# EasyEDA Pro project ProPrj_Xen_2025-02-04.epro, schematic Schematic1

## Sheets
1 Multiplex: Board Name: XenController; Create Date: 2024-12-16; Page Name: Multiplex; Project Name: Xen; Schematic Name: Schematic1; Update Date: 2025-01-13; Company: EasyEDA.com; Drawn: EasyEDA; Page Size: A4; Part Number: JLCPCB-002; Reviewed: EasyEDA; Version: V0.1
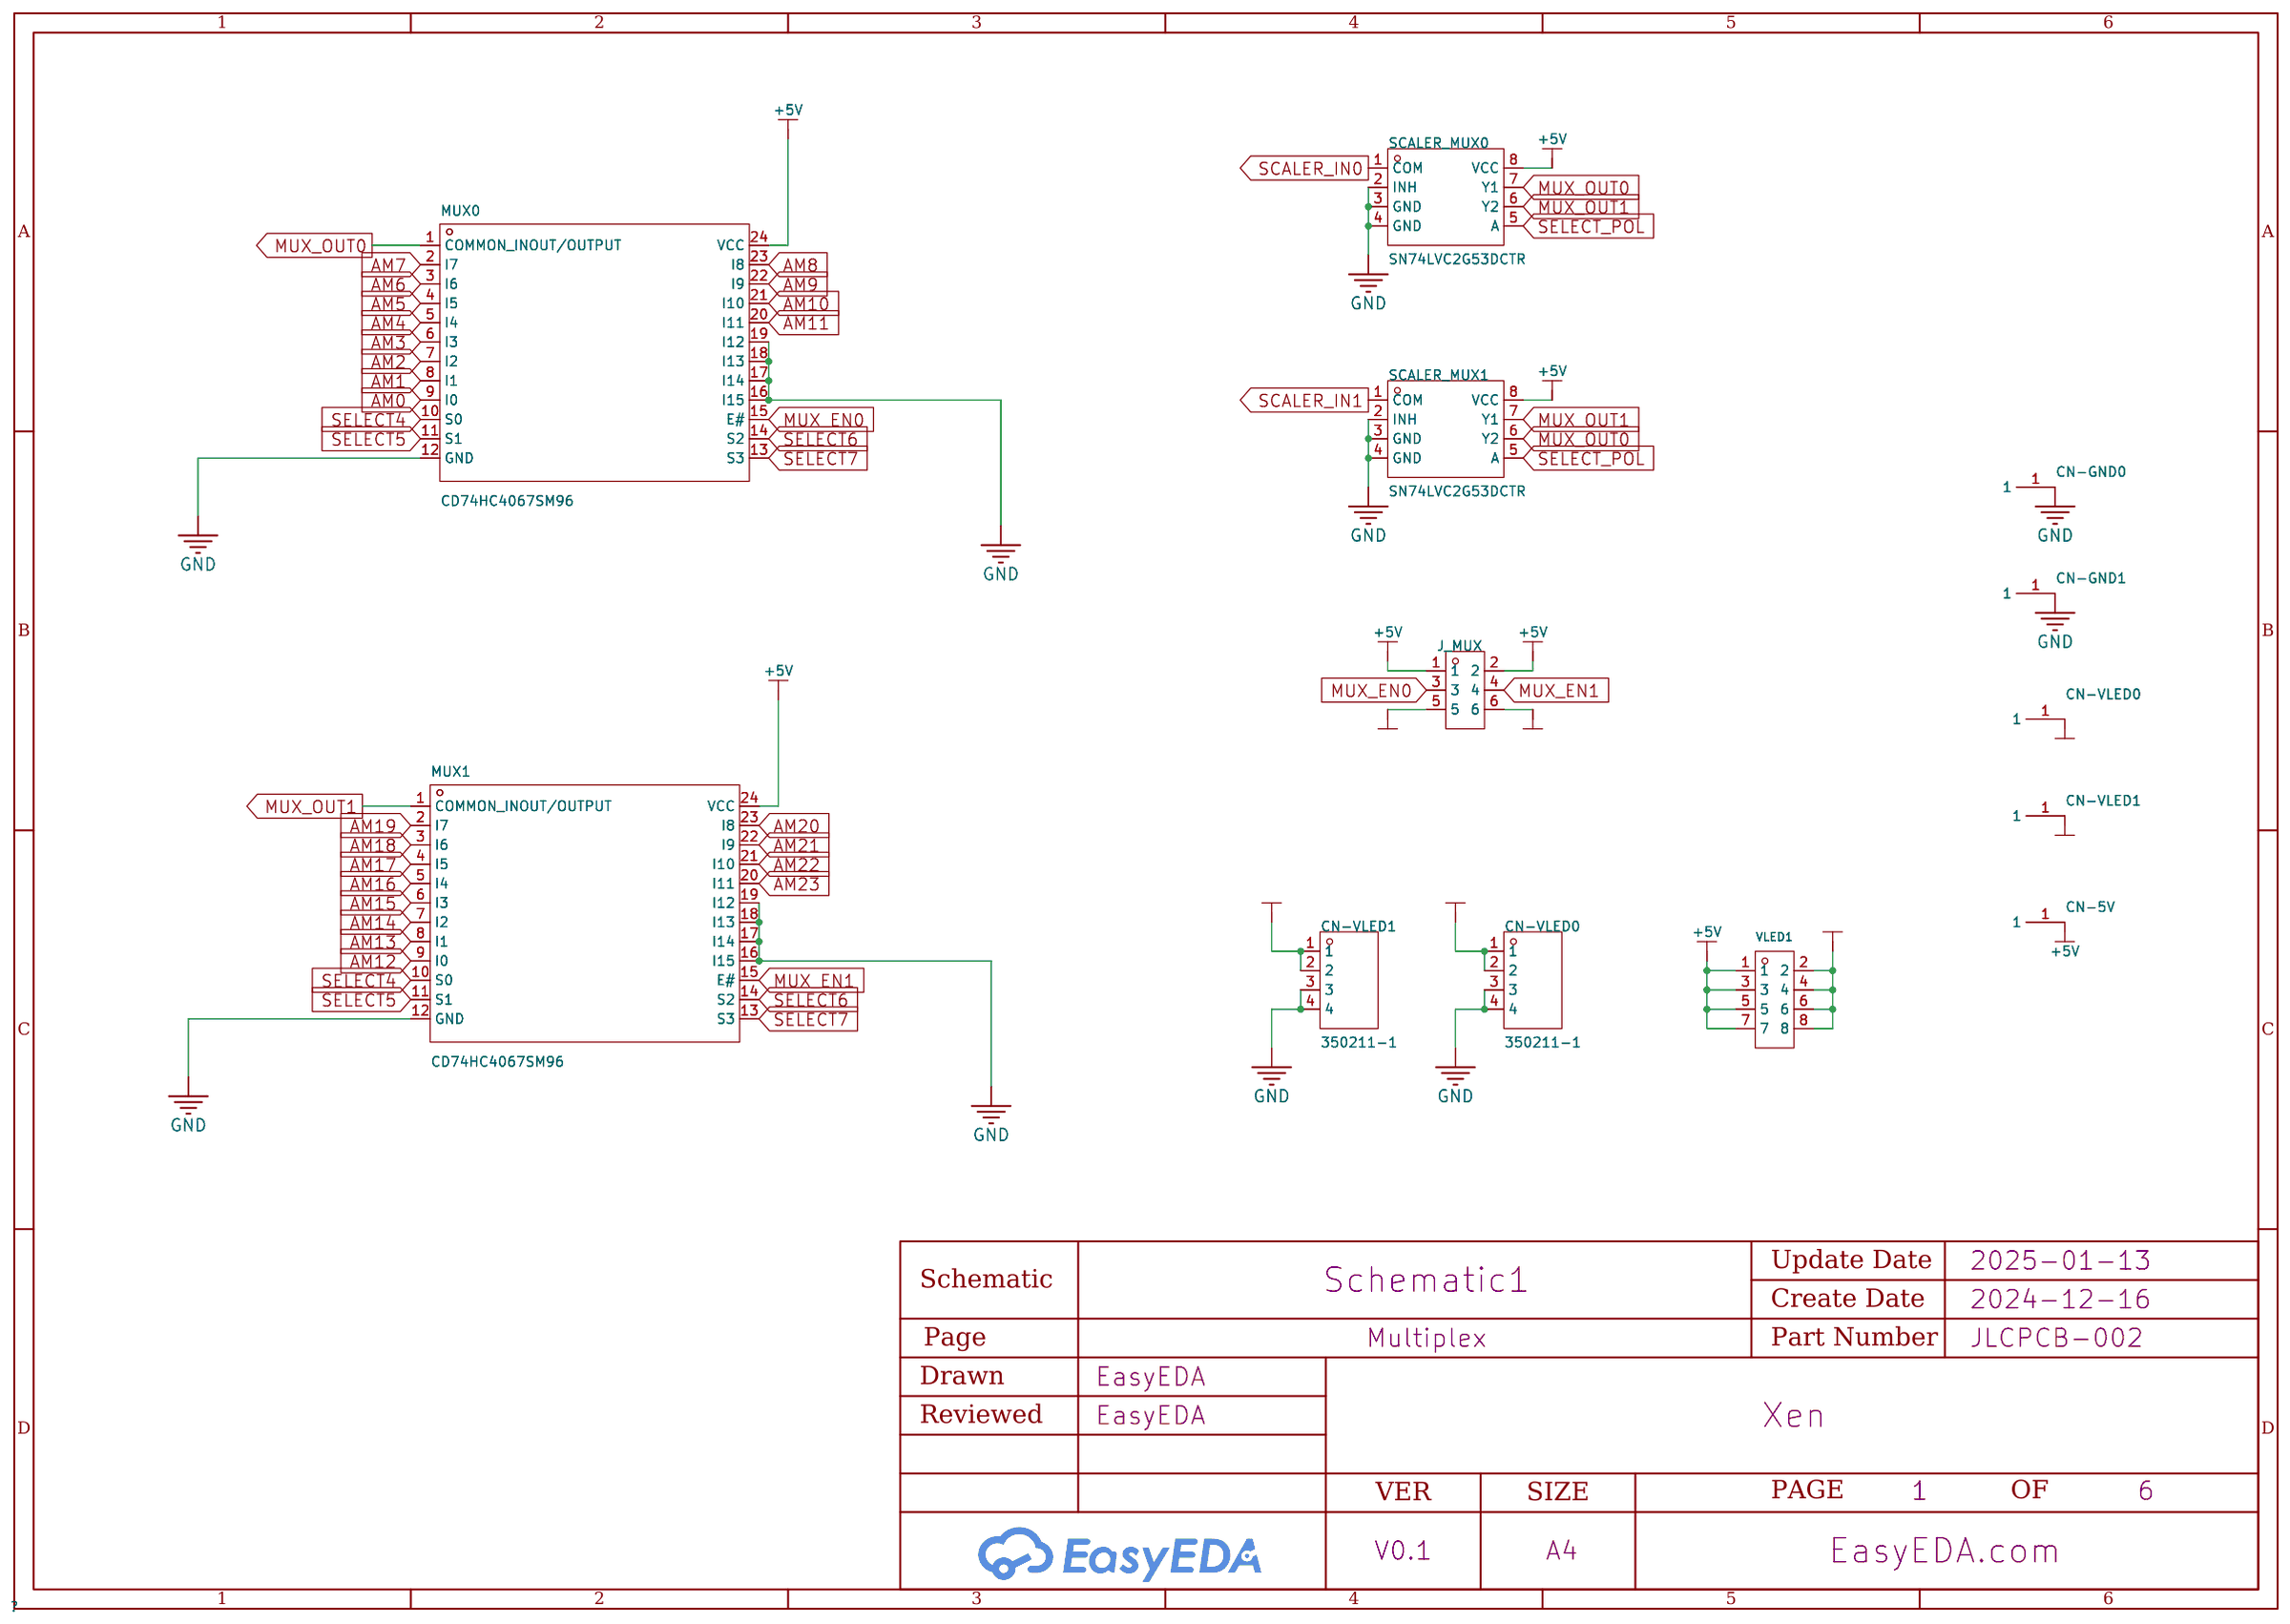
[diagram p15: Multiplex]
2 Scaler: Page Name: Scaler
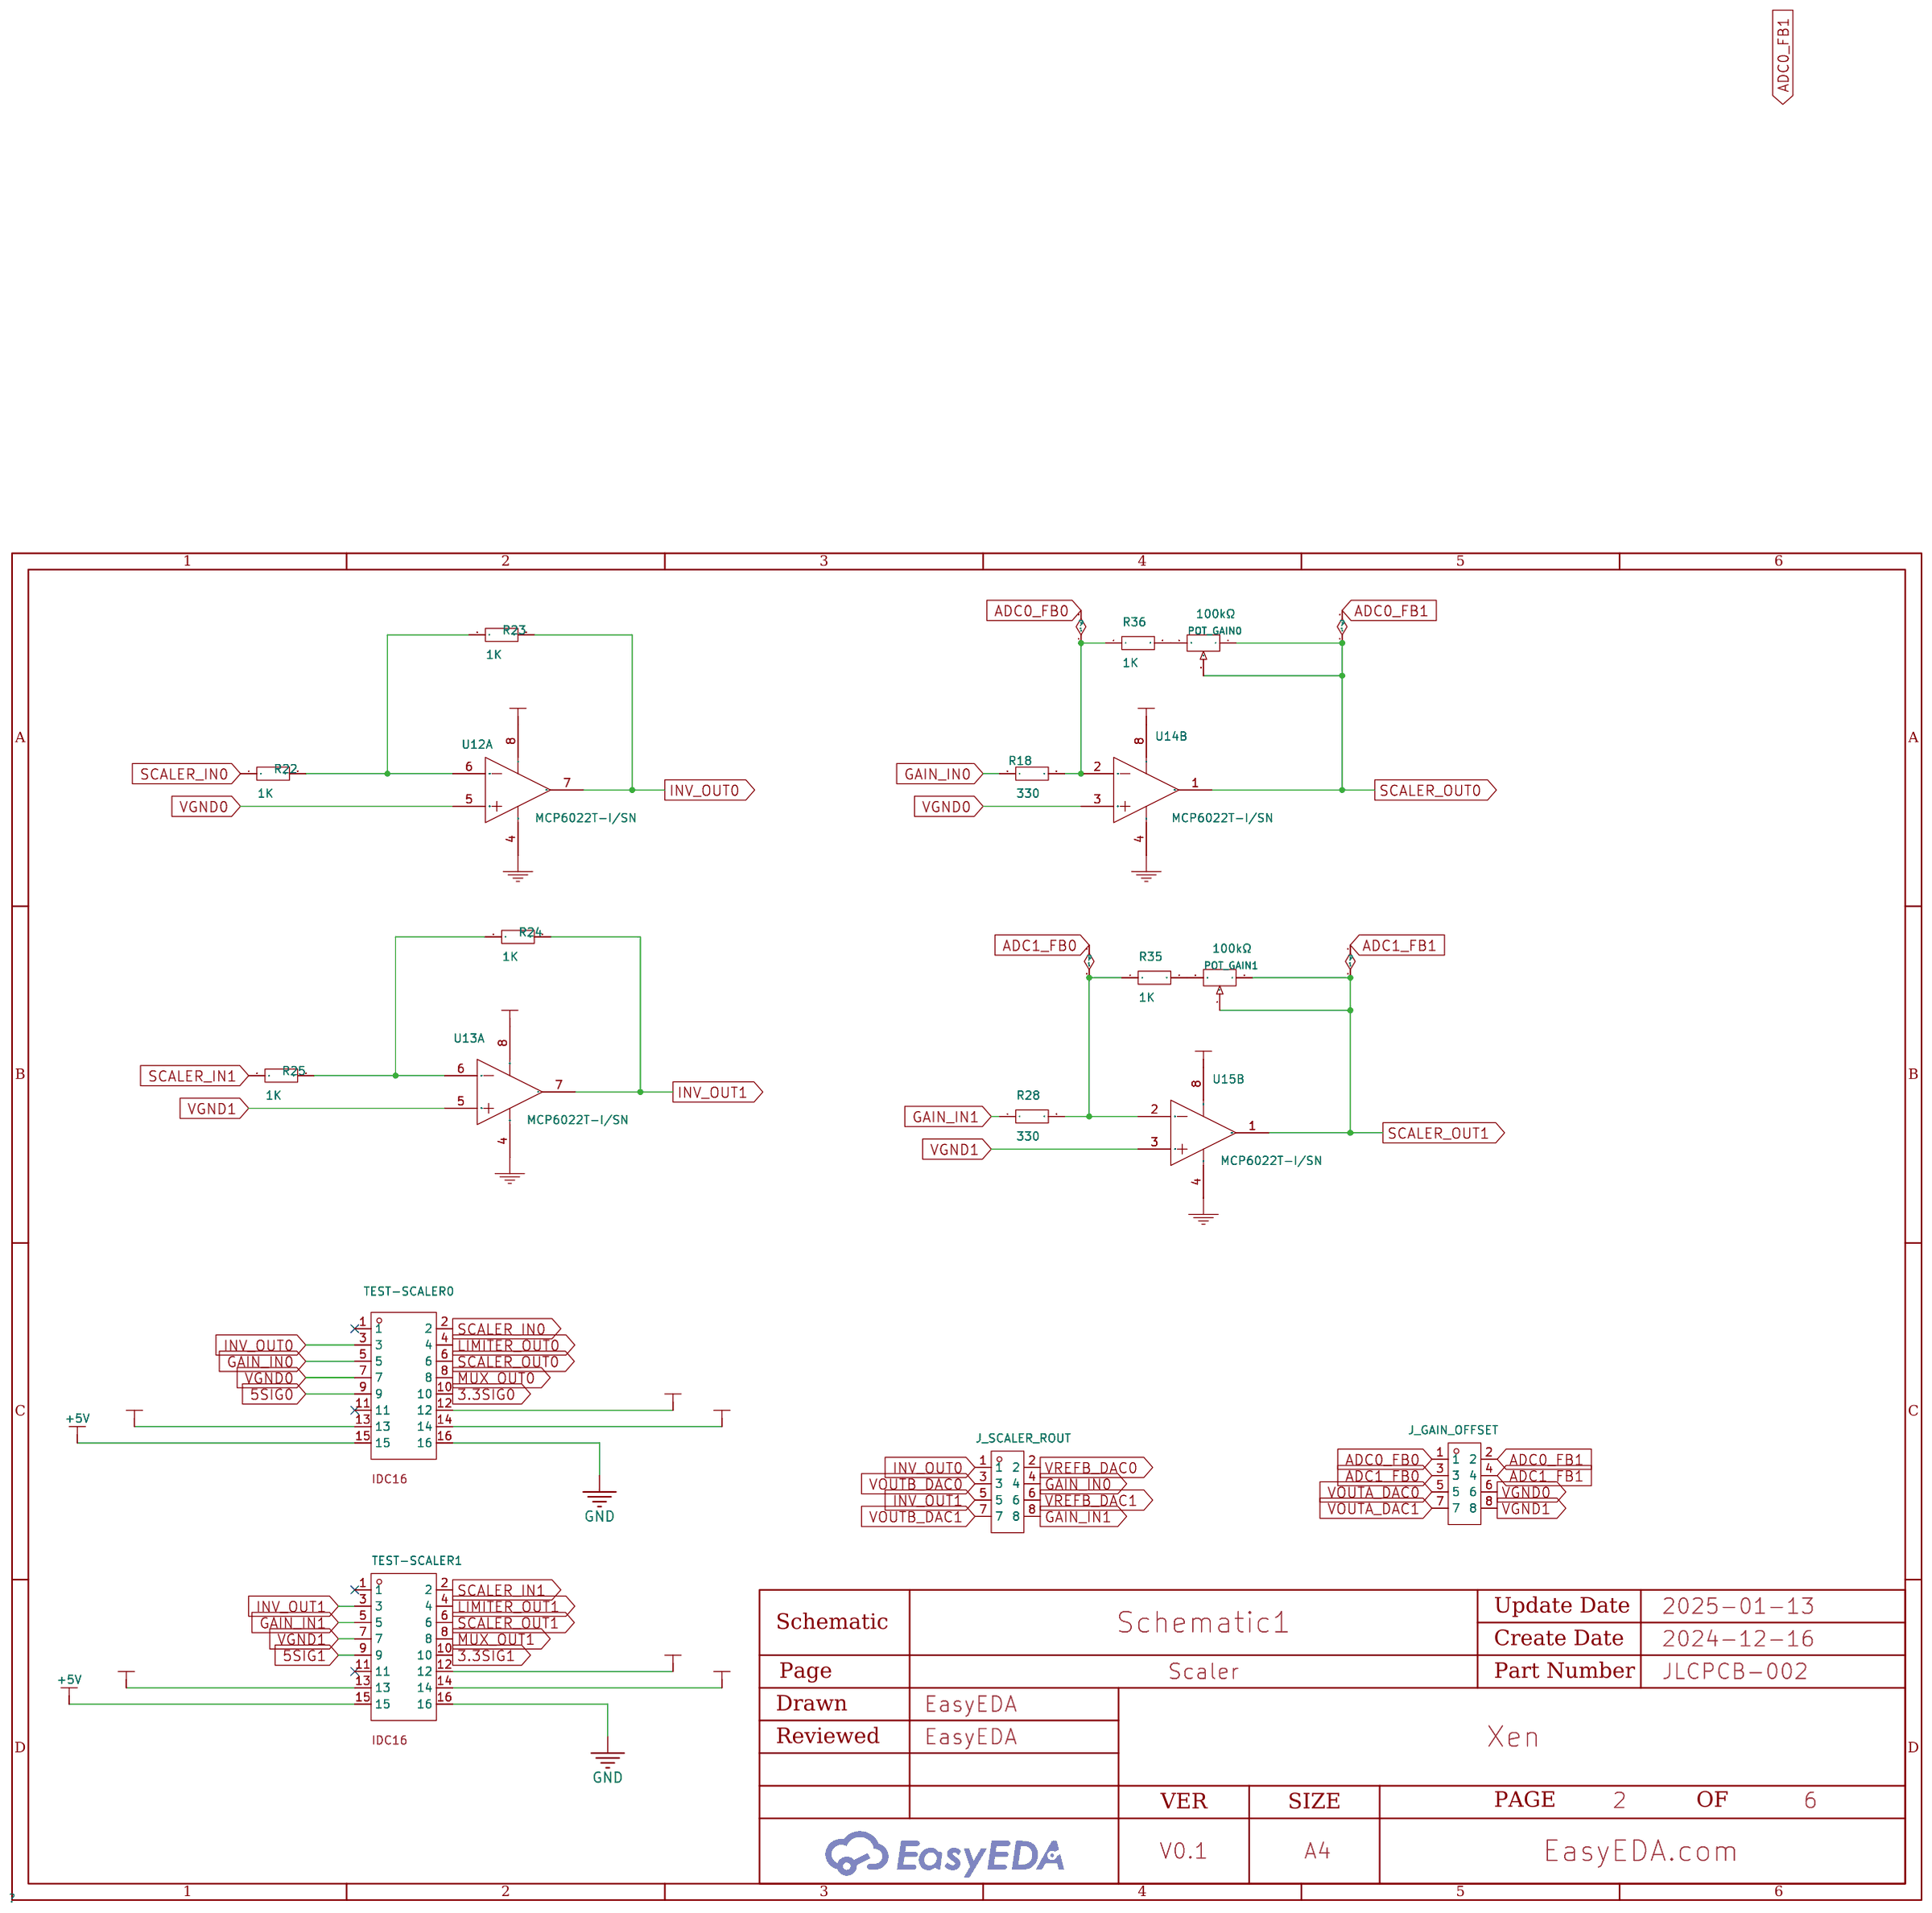
[diagram p16: Scaler]
3 Teensy: Create Date: 2024-12-22; Page Name: Teensy; Update Date: 2025-01-17
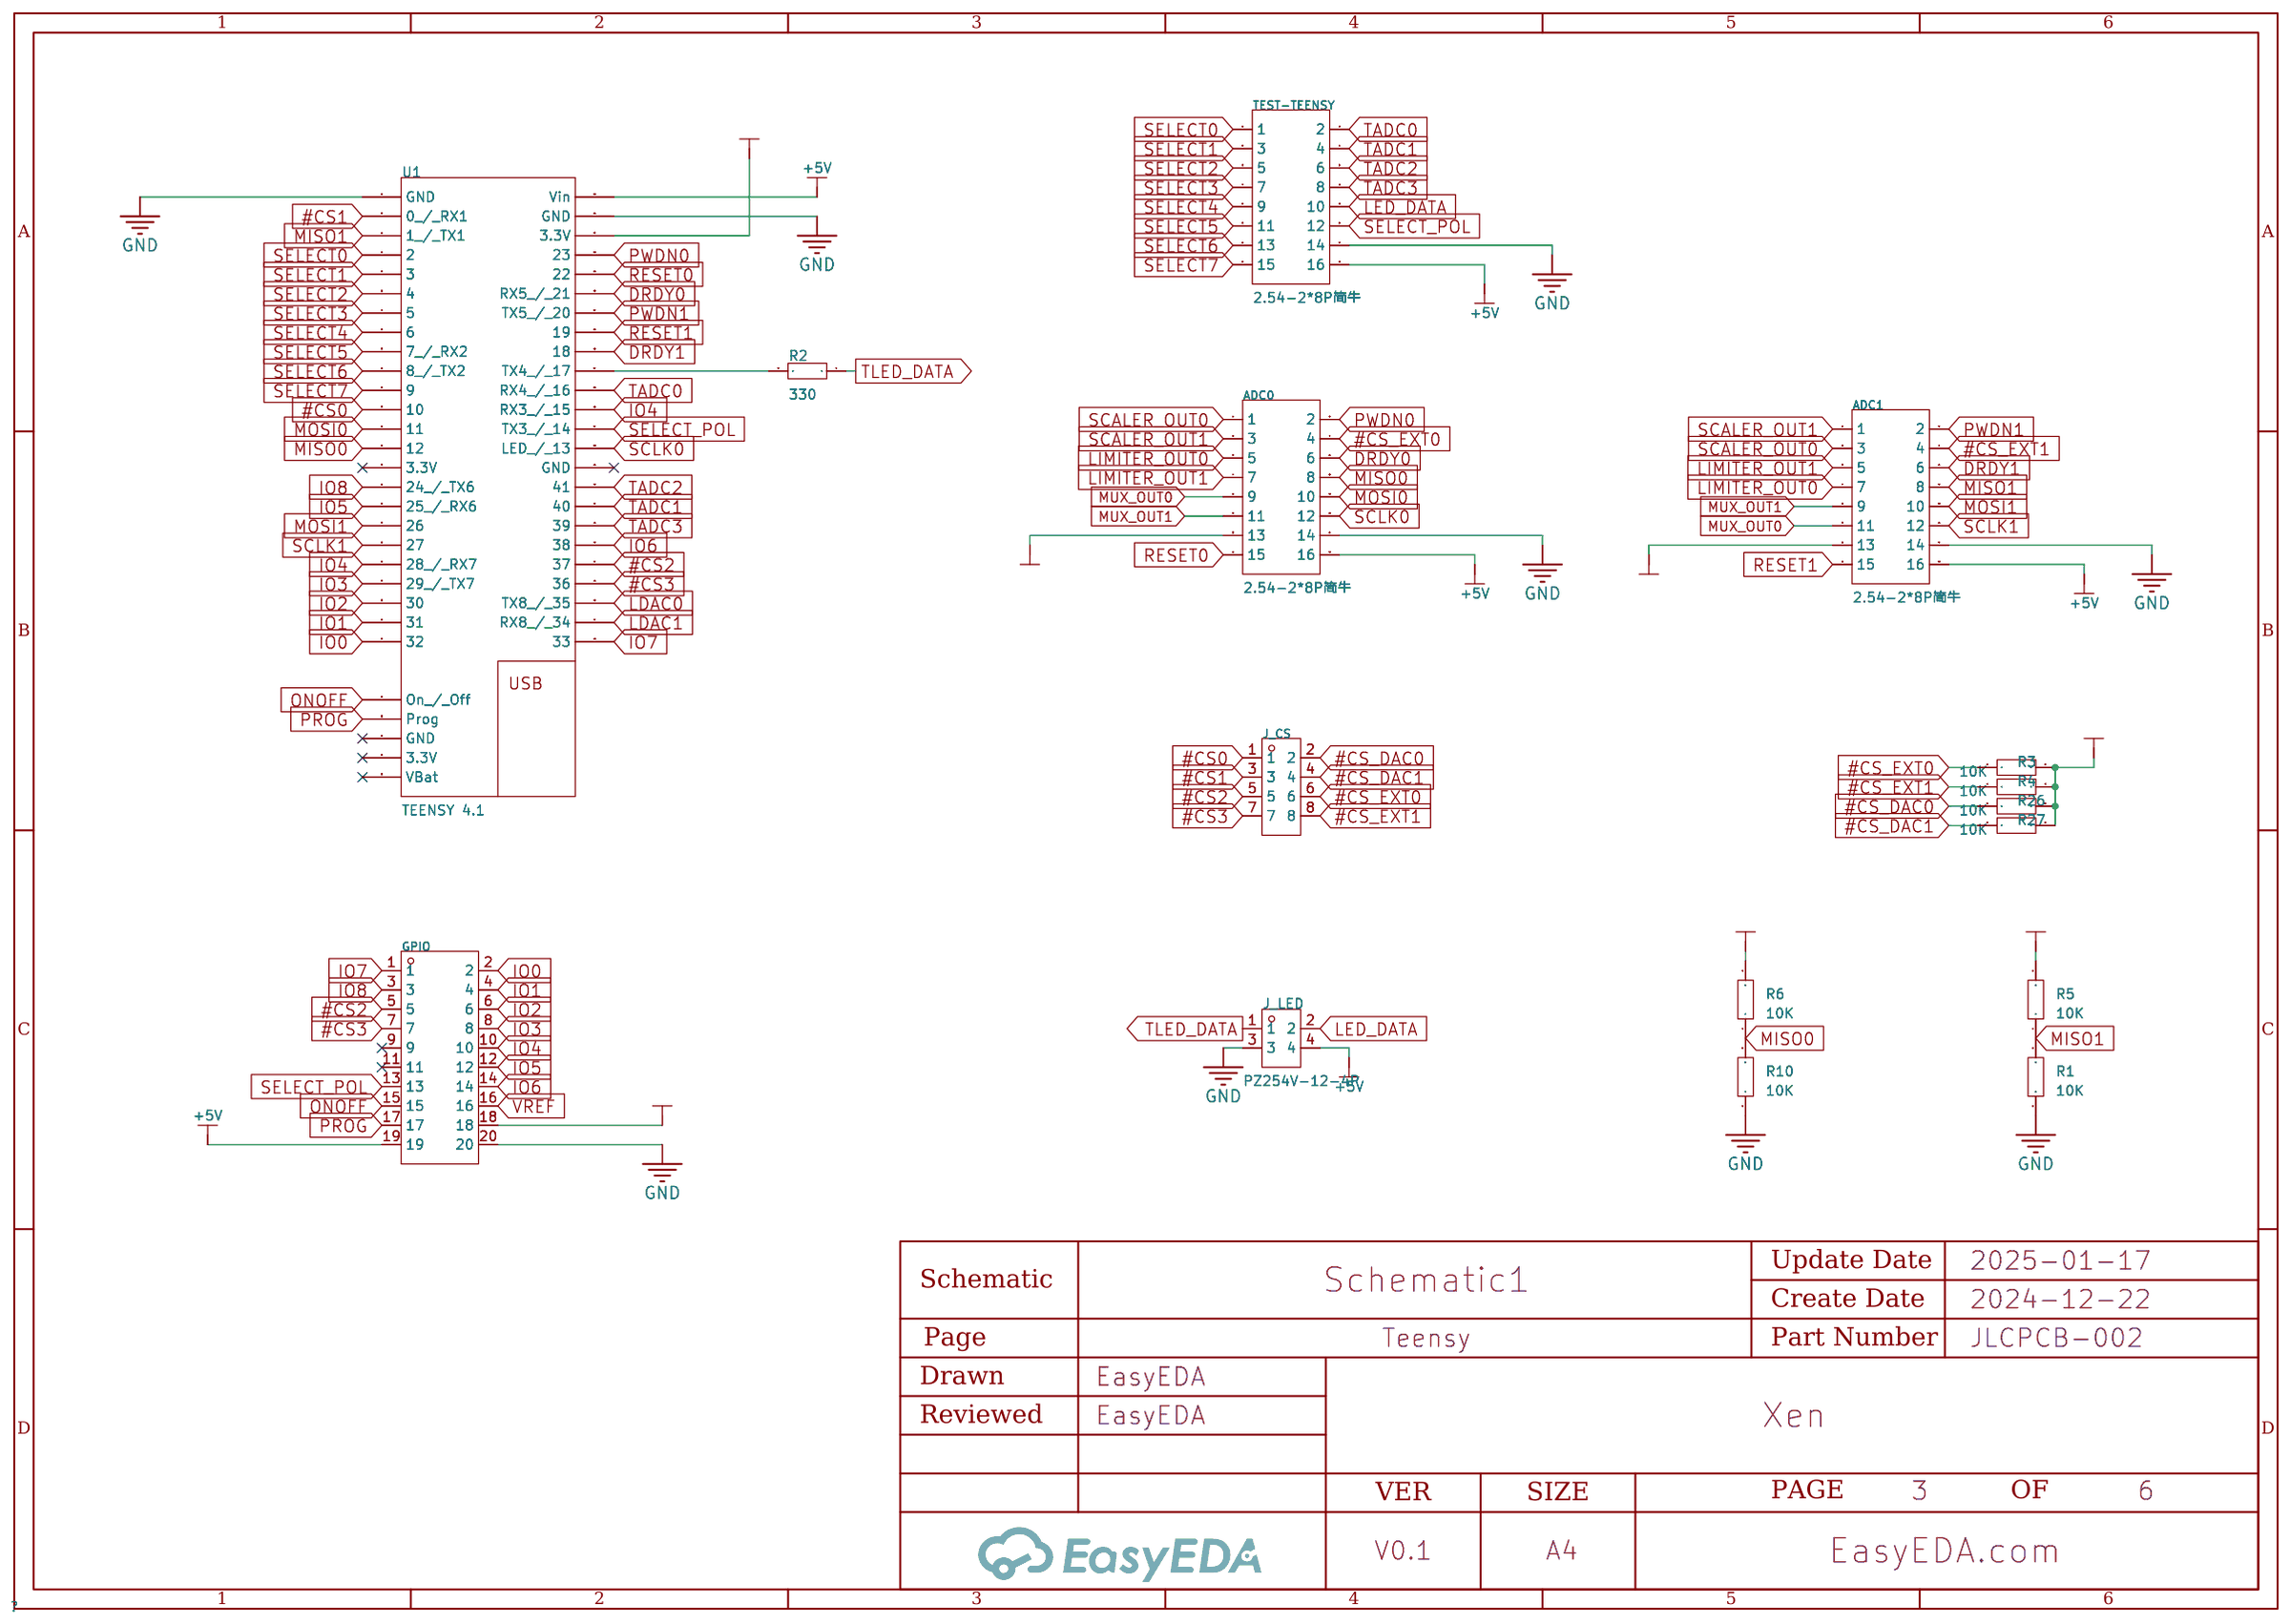
[diagram p17: Teensy]
4 Connects: Create Date: 2024-12-22; Page Name: Connects; Update Date: 2024-12-22
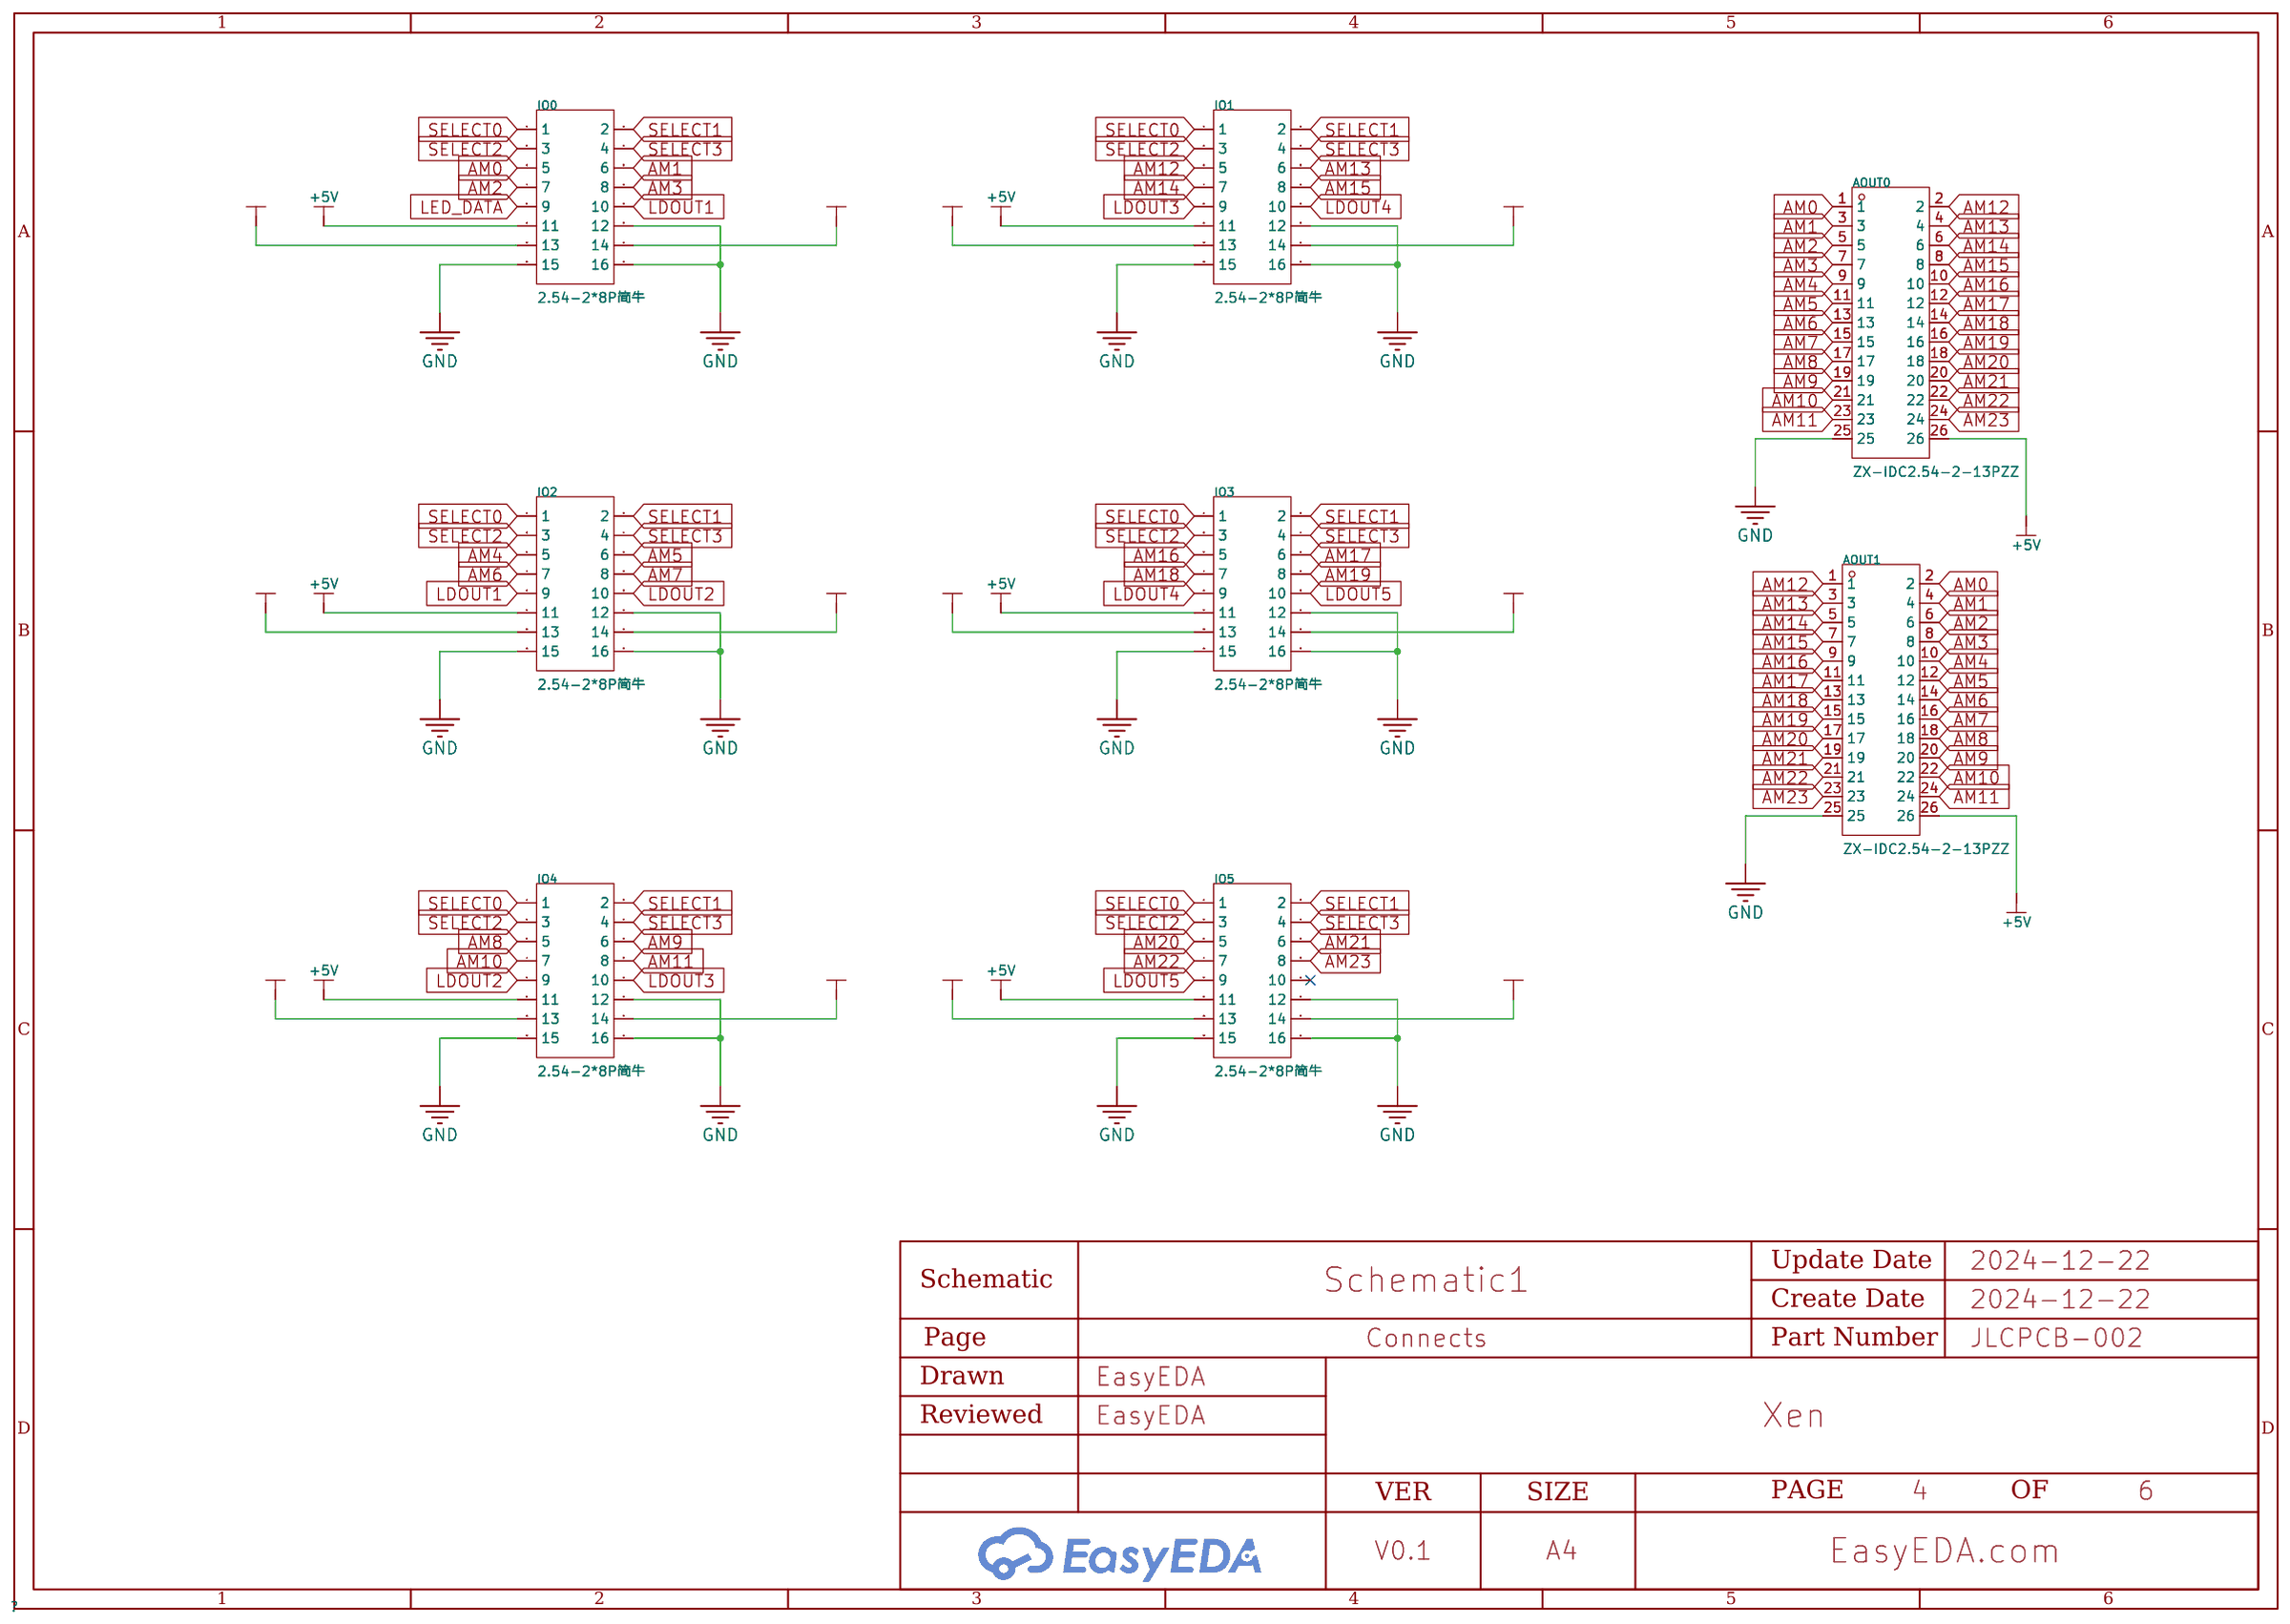
[diagram p18: Connects]
5 Limiter: Create Date: 2025-01-10; Page Name: Limiter; Update Date: 2025-01-17
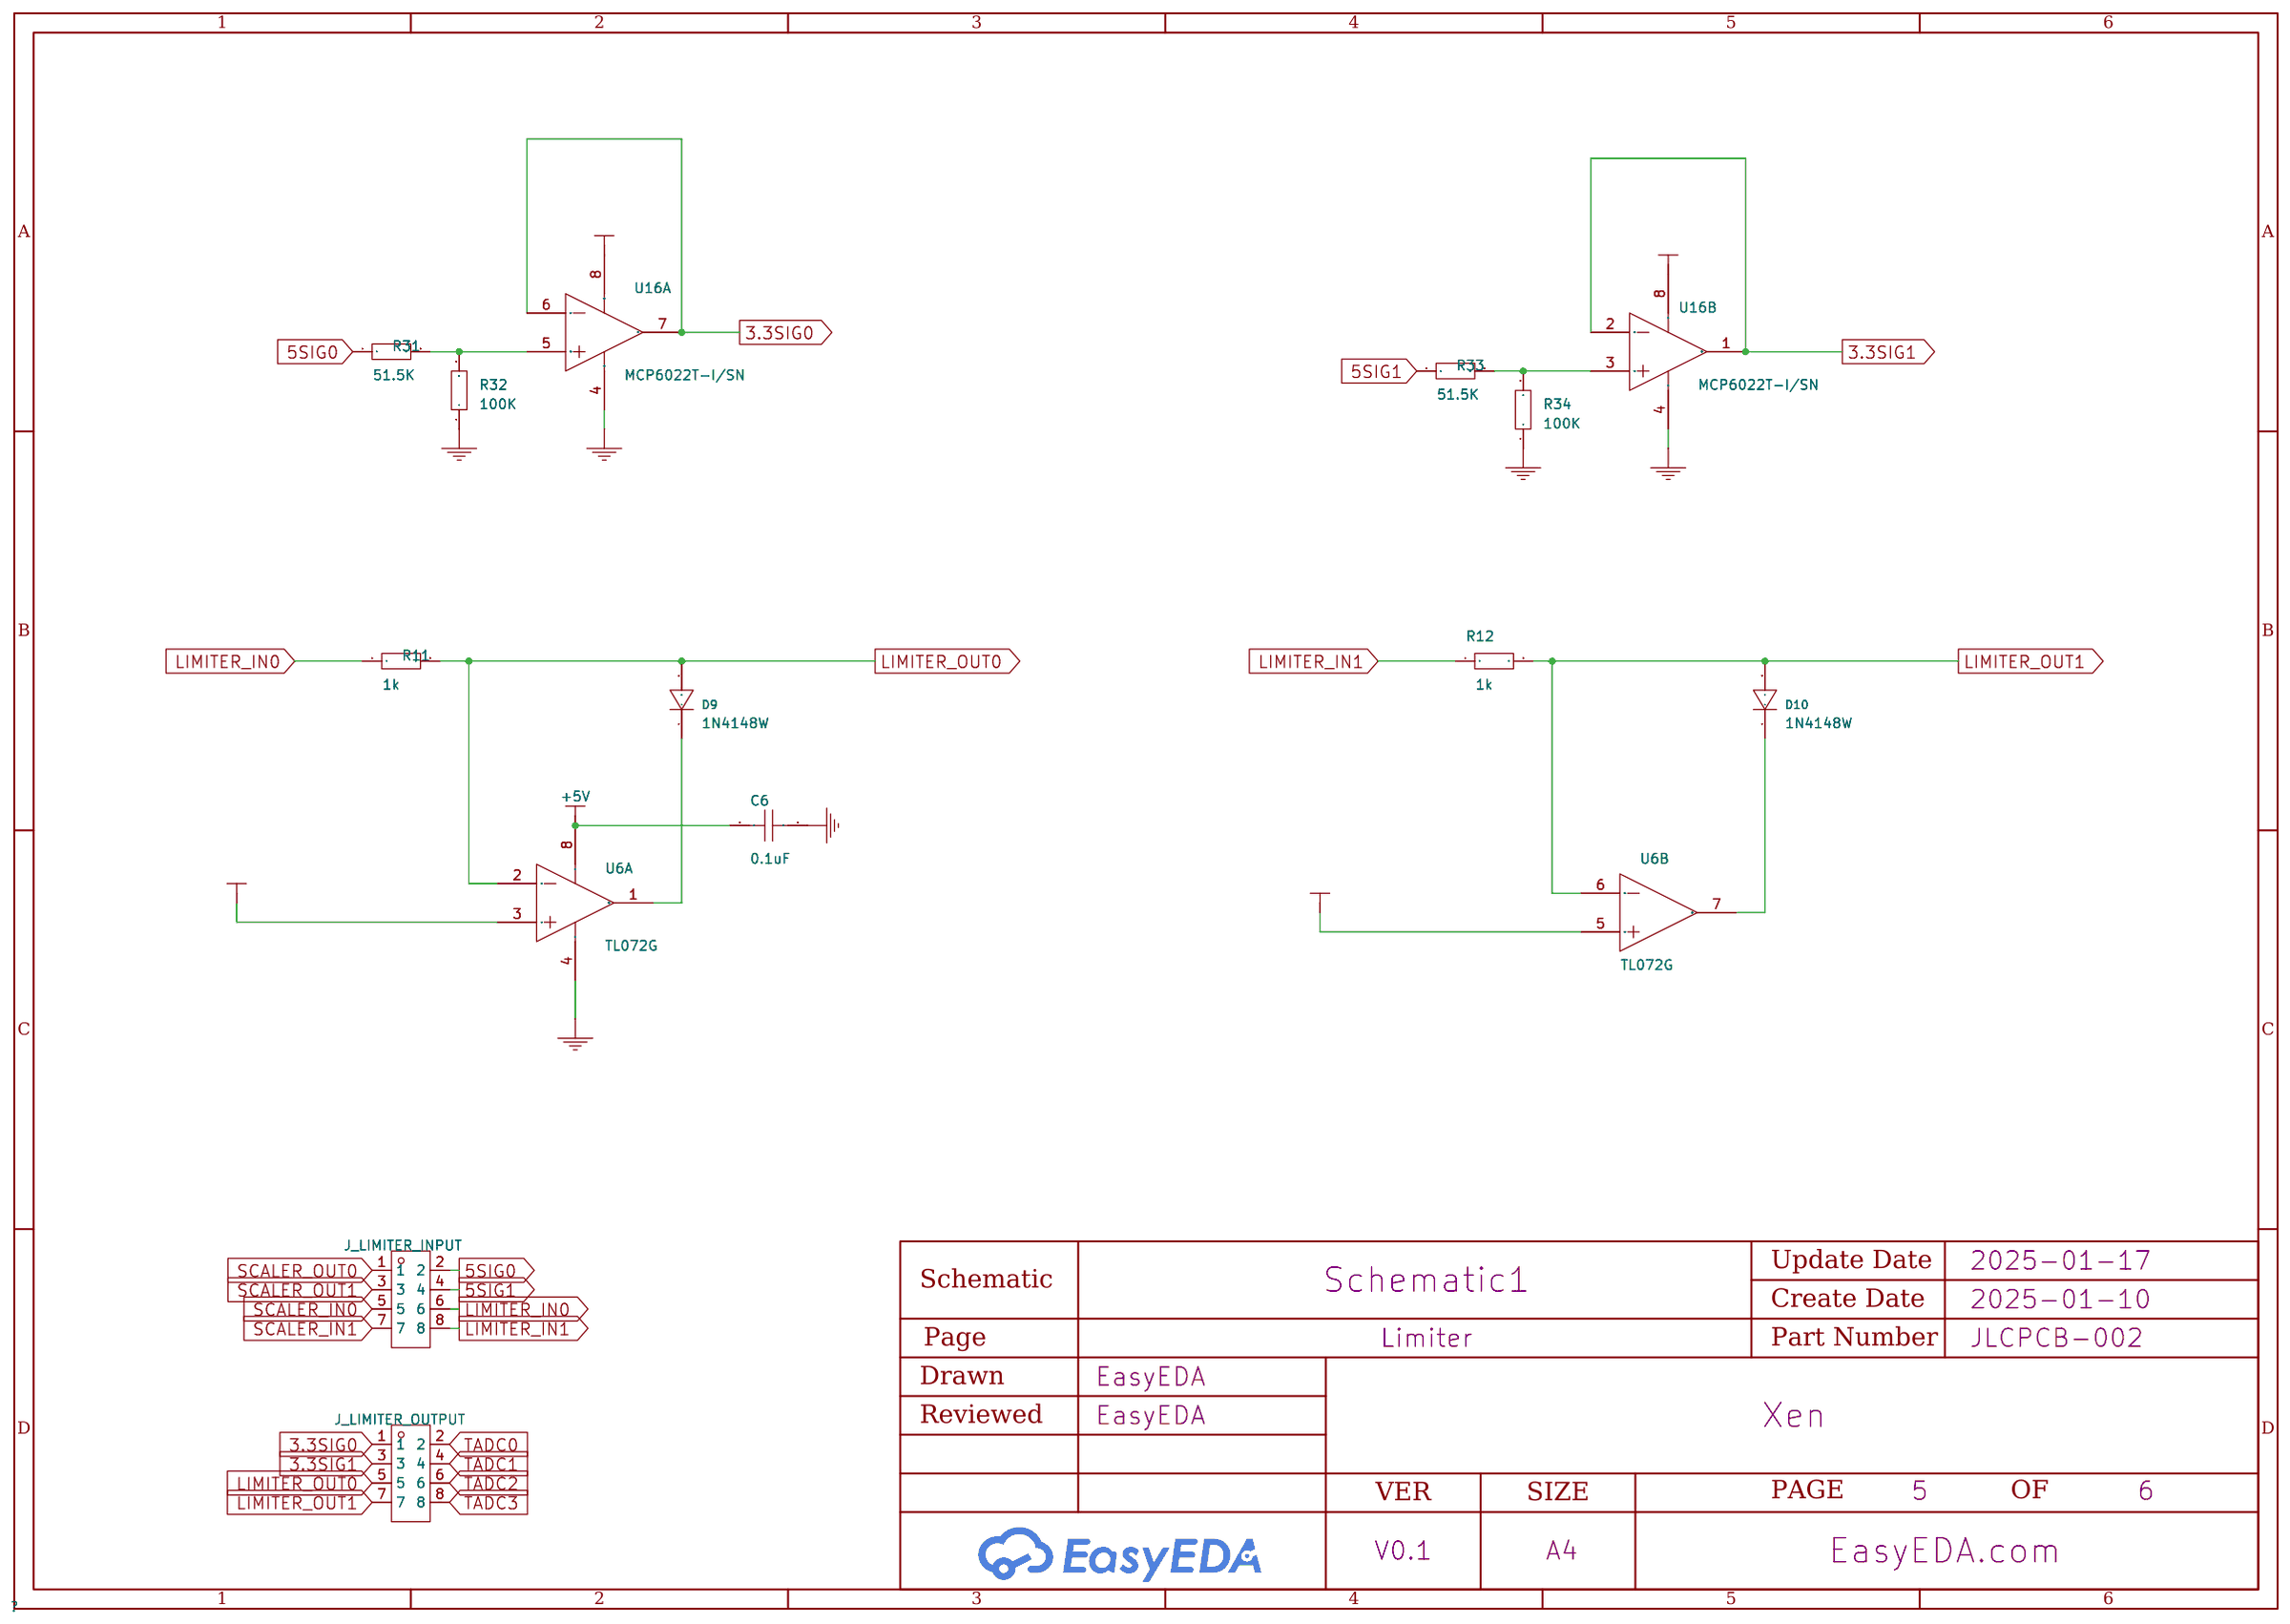
[diagram p19: Limiter]
6 DAC: Create Date: 2025-01-13; Page Name: DAC; Update Date: 2025-01-17
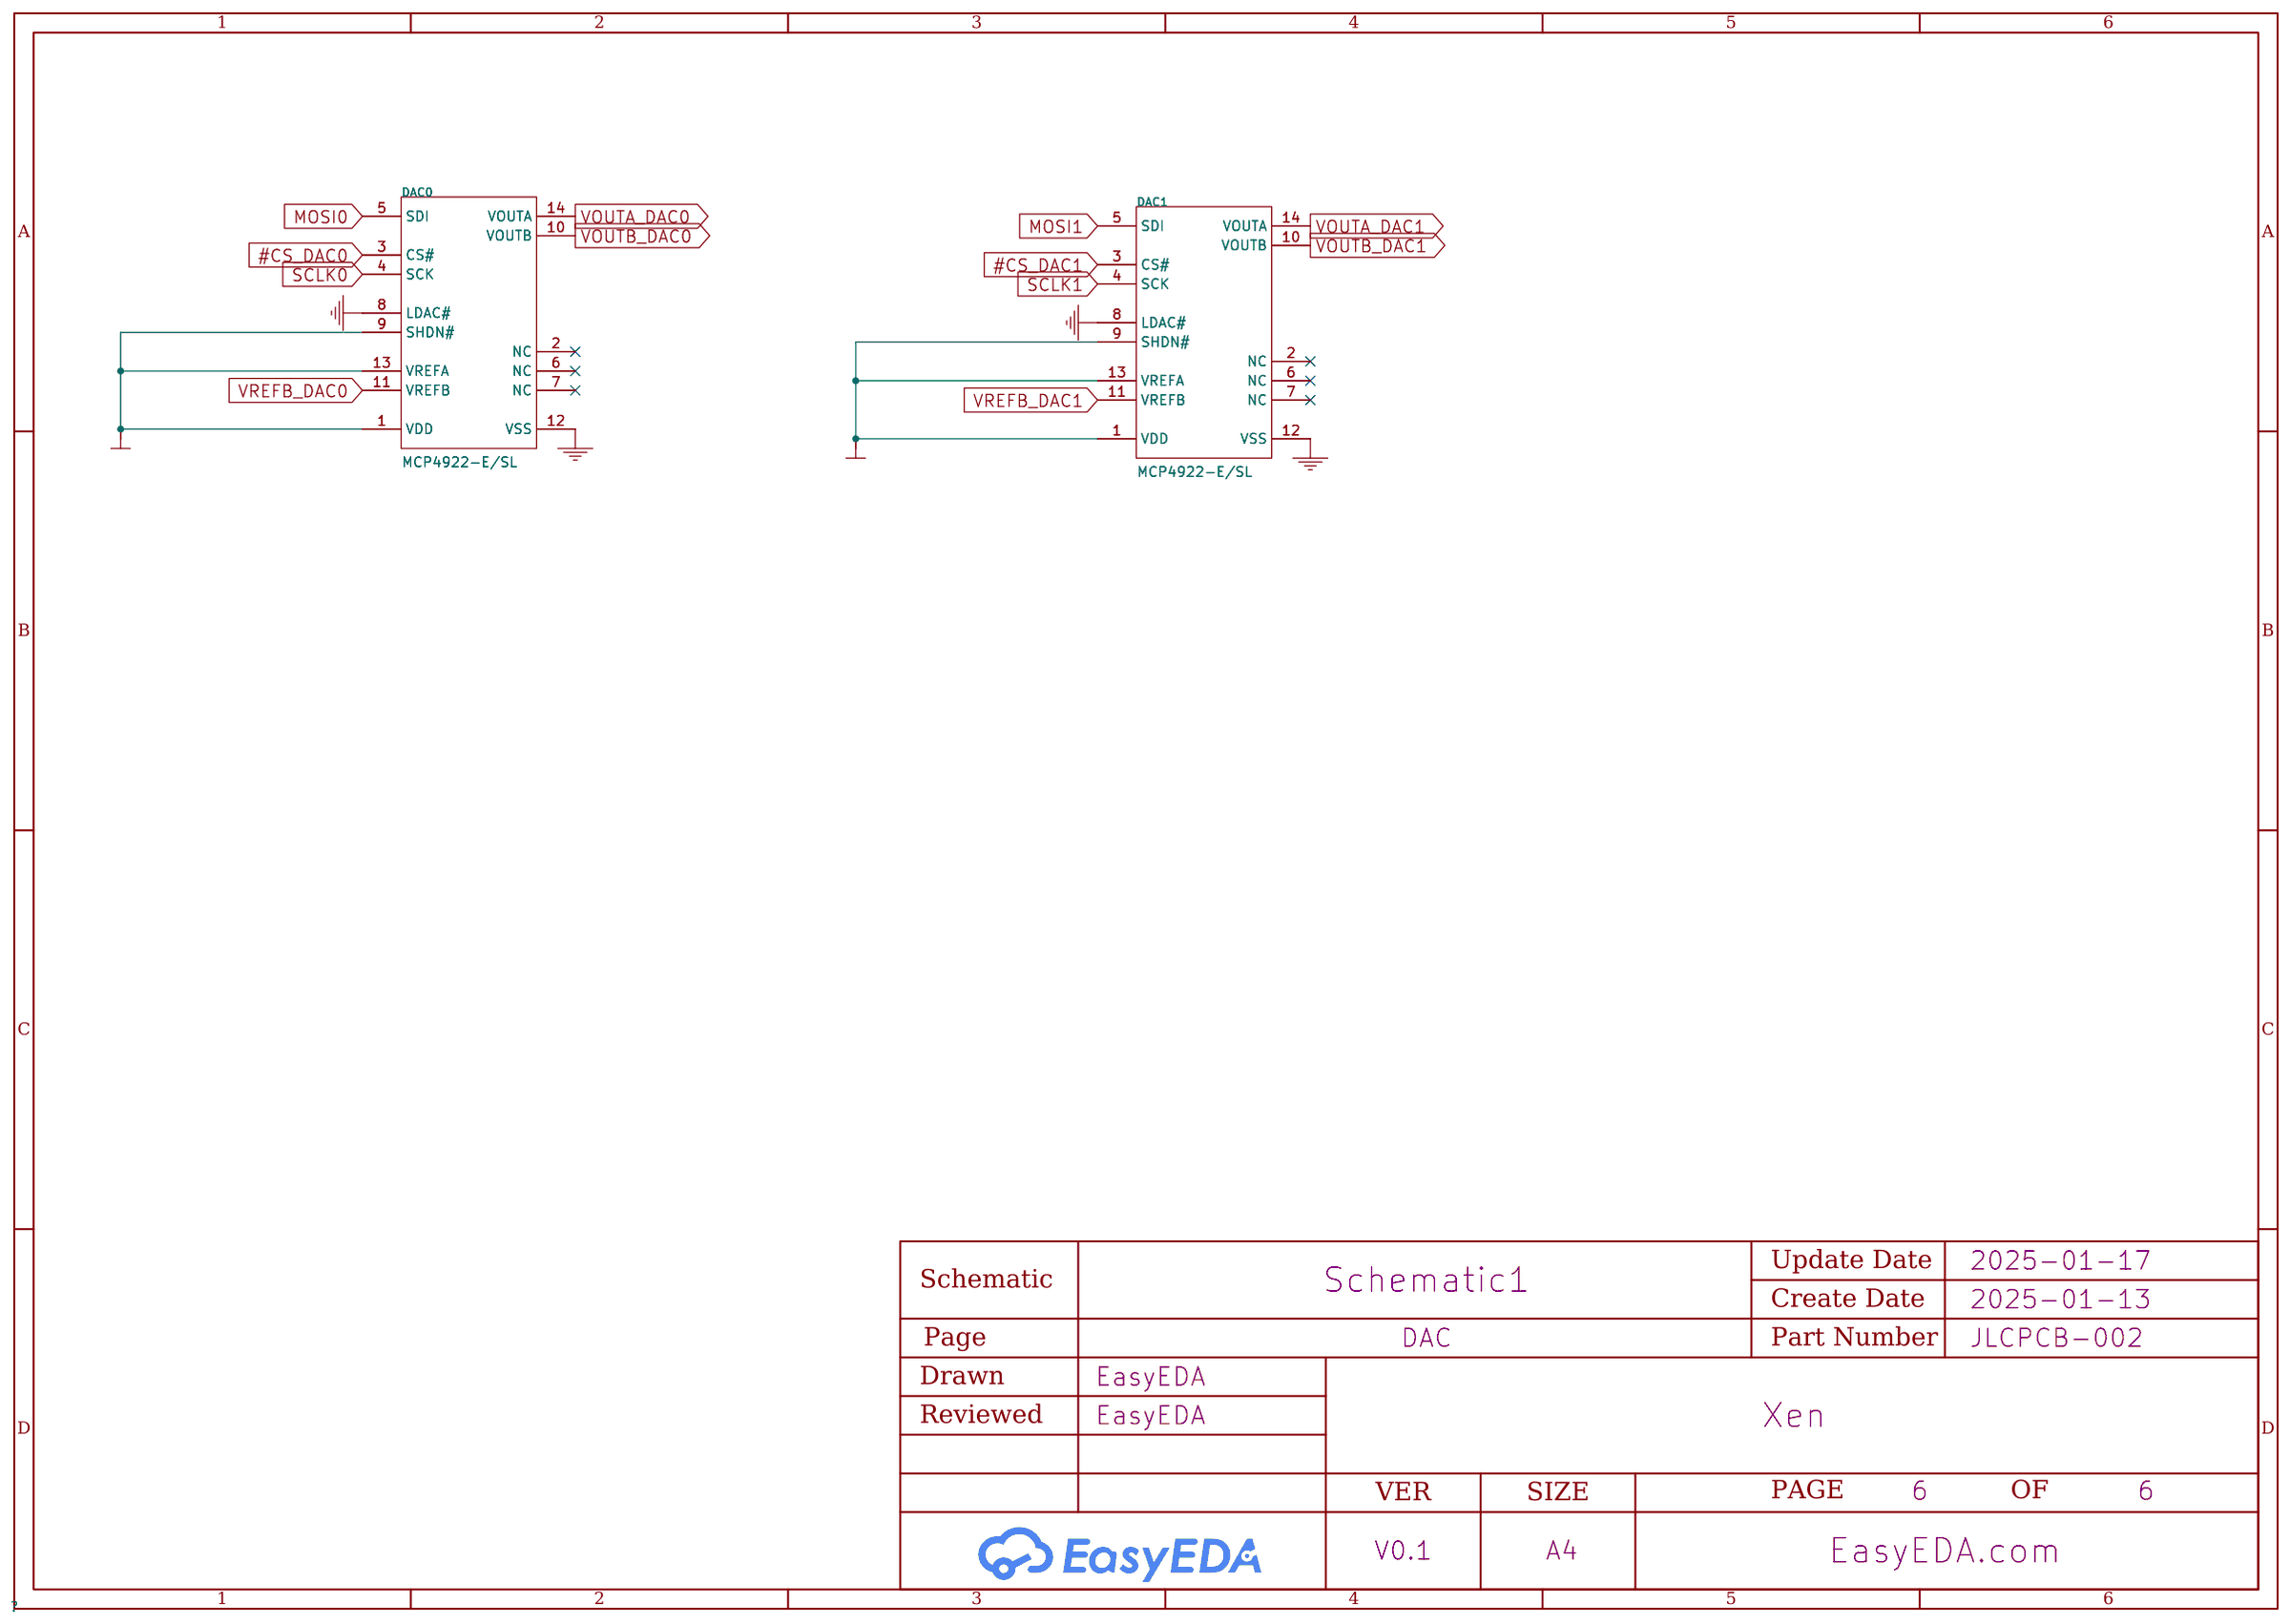
[diagram p20: DAC]

## Parts
sheet Connects
AOUT0  ZX-IDC2.54-2-13PZZ  [IDC-TH_26P-P2.54_ZX-IDC2.54-2-13PZZ]
AOUT1  ZX-IDC2.54-2-13PZZ  [IDC-TH_26P-P2.54_ZX-IDC2.54-2-13PZZ]
IO0  2.54-2*8P简牛  [IDC-TH_16P-P2.54_C3406]
IO1  2.54-2*8P简牛  [IDC-TH_16P-P2.54_C3406]
IO2  2.54-2*8P简牛  [IDC-TH_16P-P2.54_C3406]
IO3  2.54-2*8P简牛  [IDC-TH_16P-P2.54_C3406]
IO4  2.54-2*8P简牛  [IDC-TH_16P-P2.54_C3406]
IO5  2.54-2*8P简牛  [IDC-TH_16P-P2.54_C3406]
sheet DAC
DAC0  MCP4922-E/SL  [SOIC-14_L8.7-W3.9-P1.27-LS6.0-BL]
DAC1  MCP4922-E/SL  [SOIC-14_L8.7-W3.9-P1.27-LS6.0-BL]
sheet Limiter
C6  0.1uF  [C0603]
D9  1N4148W  [SOD-123F_L2.7-W1.6-LS3.8-RD]
D10  1N4148W  [SOD-123F_L2.7-W1.6-LS3.8-RD]
J_LIMITER_INPUT  ZX-PZ2.54-2-4PZZ  [HDR-TH_8P-P2.54-V-M-R2-C4-S2.54]
J_LIMITER_OUTPUT  ZX-PZ2.54-2-4PZZ  [HDR-TH_8P-P2.54-V-M-R2-C4-S2.54]
R11  1k  [R0603]
R12  1k  [R0603]
R31  51.5K  [R0603]
R32  100K  [R0603]
R33  51.5K  [R0603]
R34  100K  [R0603]
U6  TL072G  [SOIC-8_L4.9-W3.9-P1.27-LS6.0-BL]  (sections 1,2)
U16  MCP6022T-I/SN  [SOIC-8_L4.9-W3.9-P1.27-LS6.0-BL]  (sections 1,2)
sheet Multiplex
CN-5V  -  [VIA]
CN-GND0  -  [VIA]
CN-GND1  -  [VIA]
CN-VLED0  350211-1  [CONN-TH_350211-1]
CN-VLED0#2  -  [VIA]
CN-VLED1  -  [VIA]
CN-VLED1#2  350211-1  [CONN-TH_350211-1]
J_MUX  ZX-PZ2.54-2-3PZZ  [HDR-TH_6P-P2.54-V-M-R2-C3-S2.54-1]
MUX0  CD74HC4067SM96  [SSOP-24_L8.1-W5.3-P0.65-LS7.8-BL]
MUX1  CD74HC4067SM96  [SSOP-24_L8.1-W5.3-P0.65-LS7.8-BL]
SCALER_MUX0  SN74LVC2G53DCTR  [MSOP-8_L2.9-W2.8-P0.65-LS4.0-BR]
SCALER_MUX1  SN74LVC2G53DCTR  [MSOP-8_L2.9-W2.8-P0.65-LS4.0-BR]
VLED1  PZ2.54-2*4  [HDR-TH_8P-P2.54-V-M-R2-C4-S2.54]
sheet Scaler
J_GAIN_OFFSET  ZX-PZ2.54-2-4PZZ  [HDR-TH_8P-P2.54-V-M-R2-C4-S2.54]
J_SCALER_ROUT  ZX-PZ2.54-2-4PZZ  [HDR-TH_8P-P2.54-V-M-R2-C4-S2.54]
POT_GAIN0  100kΩ  [RES-ADJ-TH_3P-L9.5-W4.9-P2.50-L_3296W]
POT_GAIN1  100kΩ  [RES-ADJ-TH_3P-L9.5-W4.9-P2.50-L_3296W]
R18  330  [R0603]
R22  1K  [R0603]
R23  1K  [R0603]
R24  1K  [R0603]
R25  1K  [R0603]
R28  330  [R0603]
R35  1K  [R0603]
R36  1K  [R0603]
TEST-SCALER0  IDC16  [CONN-TH_16P-P2.54_TE_1761681-6]
TEST-SCALER1  IDC16  [CONN-TH_16P-P2.54_TE_1761681-6]
U12  MCP6022T-I/SN  [SOIC-8_L4.9-W3.9-P1.27-LS6.0-BL]  (section 1)
U13  MCP6022T-I/SN  [SOIC-8_L4.9-W3.9-P1.27-LS6.0-BL]  (section 1)
U14  MCP6022T-I/SN  [SOIC-8_L4.9-W3.9-P1.27-LS6.0-BL]  (section 2)
U15  MCP6022T-I/SN  [SOIC-8_L4.9-W3.9-P1.27-LS6.0-BL]  (section 2)
sheet Teensy
ADC0  2.54-2*8P简牛  [IDC-TH_16P-P2.54_C3406]
ADC1  2.54-2*8P简牛  [IDC-TH_16P-P2.54_C3406]
GPIO  ZX-IDC2.54-2-10PZZ  [IDC-TH_20P-P2.54_ZX-IDC2.54-2-10PZZ]
J_CS  PZ2.54-2*4  [HDR-TH_8P-P2.54-V-M-R2-C4-S2.54]
J_LED  PZ254V-12-4P  [HDR-TH_4P-P2.54-V-M-R2-C2-S2.54]
R1  10K  [R0603]
R2  330  [R0603]
R3  10K  [R0603]
R4  10K  [R0603]
R5  10K  [R0603]
R6  10K  [R0603]
R10  10K  [R0603]
R26  10K  [R0603]
R27  10K  [R0603]
TEST-TEENSY  2.54-2*8P简牛  [IDC-TH_16P-P2.54_C3406]
U1  TEENSY 4.1  [TEENSY 4.1]

## Library data of the parts
AOUT0 AOUT1 = ZX-IDC2.54-2-13PZZ: Connector Type:简牛座 Pitch:2.54mm Structure:2x13P Current Rating (Max):3A Voltage Rating (Max):1kV Holder Type:Straight Row Spacing:2.54mm Number of Rows:2 Pin Number in each Row:13 Contact Material:Brass Contact Plating:Gold Operating Temperature Range:-40; LCSC Part Name: 2.54mm 2x13P 排数:2 每排P数:13; Supplier Part: C7501247; Manufacturer: Megastar(兆星); Supplier Footprint: 插件,P=2.54mm; JLCPCB Part Class: Extended Part; Datasheet: https://atta.szlcsc.com/upload/public/pdf/source/20231122/C34A0102EBF117114DD7A9F9DEFF8982.pdf; Supplier: LCSC; Connector Type: 简牛座; Pitch: 2.54mm; Structure: 2x13P; Current Rating (Max): 3A; Voltage Rating (Max): 1kV; Holder Type: Straight; Row Spacing: 2.54mm; Number of Rows: 2; Pin Number in each Row: 13; Contact Material: Brass; Contact Plating: Gold; Operating Temperature Range: -40℃~+105℃; Soldering Temperature(Max): 260℃@10S
ADC0 ADC1 IO0-IO5 TEST-TEENSY = 2.54-2*8P简牛: Connector Type:简牛座 Pitch:2.54mm Structure:2x8P Holder Type:Straight Row Spacing:2.54mm Number of Rows:2 Pin Number in each Row:8 Contact Material:- Contact Plating:-; LCSC Part Name: 2.54mm 2x8P 排数:2 每排P数:8; Supplier Part: C3406; Manufacturer: BOOMELE(博穆精密); Supplier Footprint: 插件,P=2.54mm; JLCPCB Part Class: Extended Part; Datasheet: https://atta.szlcsc.com/upload/public/pdf/source/20131122/1457706661483.pdf; Supplier: LCSC; Connector Type: 简牛座; Pitch: 2.54mm; Structure: 2x8P; Holder Type: Straight; Row Spacing: 2.54mm; Number of Rows: 2; Pin Number in each Row: 8
DAC0 DAC1 = MCP4922-E/SL: Interface:SPI Output Type:Voltage-缓冲 Supply Voltage:2.7V~5.5V Supply Voltage:2.7V~5.5V Resolution:12Bit Integral nonlinearity:±4LSB；±0.25LSB Integral nonlinearity:±4LSB；±0.25LSB Settling Time:4.5us Operating Temperature:-40℃~+125℃ Operating Temperature:-4; Supplier Part: C39851; Manufacturer: MICROCHIP(美国微芯); Supplier Footprint: SOIC-14; JLCPCB Part Class: Extended Part; Datasheet: https://atta.szlcsc.com/upload/public/pdf/source/20141219/1457707255746.pdf; Supplier: LCSC; Interface: SPI; Output Type: Voltage-缓冲; Supply Voltage: 2.7V~5.5V; Resolution: 12Bit; Integral nonlinearity: ±4LSB；±0.25LSB; Settling Time: 4.5us; Operating Temperature: -40℃~+125℃
C6 = CAP_0603: Supplier Footprint: 0603
D9 D10 = 1N4148W_C81598: Diode Configuration: Forward Voltage (Vf@If):1V@50mA Reverse Voltage (Vr): Average Rectified Current (Io): Power Dissipation: Reverse Leakage Current:1uA@75V Reverse Recovery Time (trr): Operating Temperature:- Operating Temperature:-; LCSC Part Name: 电压:75V 电流:150mA; Supplier Part: C81598; Manufacturer: ST(先科); Supplier Footprint: SOD-123; JLCPCB Part Class: Basic Part; Datasheet: https://atta.szlcsc.com/upload/public/pdf/source/20161024/1477288446905.pdf; Supplier: LCSC; Forward Voltage (Vf@If): 1V@50mA; Reverse Leakage Current: 1uA@75V
J_GAIN_OFFSET J_LIMITER_INPUT J_LIMITER_OUTPUT J_SCALER_ROUT = ZX-PZ2.54-2-4PZZ: Pin Structure:2x4P Pitch:2.54mm Row Spacing:2.54mm Circluar Pins/Square Pins:Policy Mounting Type:Direct Insert Number of Rows:Double Row Number of Pins:8P Current Rating (Max):3A Voltage Rating (Max):1kV Length of Mating Pin:6mm Insulation Height:2.5mm L; LCSC Part Name: 2x4P 间距:2.54mm 方针 直插; Supplier Part: C7501275; Manufacturer: Megastar(兆星); Supplier Footprint: 插件,P=2.54mm; JLCPCB Part Class: Extended Part; Datasheet: https://atta.szlcsc.com/upload/public/pdf/source/20231122/F3A9533639C332BCBBF8B499A325EABC.pdf; Supplier: LCSC; Pin Structure: 2x4P; Pitch: 2.54mm; Row Spacing: 2.54mm; Circluar Pins/Square Pins: Policy; Mounting Type: Direct Insert; Number of Rows: Double Row; Number of Pins: 8P; Current Rating (Max): 3A; Voltage Rating (Max): 1kV; Length of Mating Pin: 6mm; Insulation Height: 2.5mm; Length of End Connection Pin: 3mm; Contact Material: Brass; Contact Plating: Gold; Operating Temperature Range: -40℃~+105℃; Color: Black
R1-R6 R10-R12 R18 R22-R28 R31-R36 = Res_0603: Supplier Footprint: 0603
U6 = TL072G: Supplier Part: C108153; Manufacturer: UTC(友顺); Supplier Footprint: SOP-8; JLCPCB Part Class: Extended Part; Datasheet: https://atta.szlcsc.com/upload/public/pdf/source/20230725/F7A3AE6E172D192144D158C404D929C8.pdf; Supplier: LCSC
U12-U16 = MCP6022T-I/SN: Number of Circuits:双路 Gain Bandwidth Product(GBP):10MHz Current - Input Bias(Ib):1pA Voltage - Input Offset(Vos):500uV Slew Rate(SR):7V/us Output Current:30mA -3db Bandwidth:- Output Type:- Rail to Rail:- Supply Current:1mA Operating Temperature:-40℃~+85℃; Supplier Part: C57639; Manufacturer: MICROCHIP(美国微芯); Supplier Footprint: SOIC-8; JLCPCB Part Class: Extended Part; Datasheet: https://atta.szlcsc.com/upload/public/pdf/source/20151020/1457707482040.pdf; Supplier: LCSC; Number of Circuits: 双路; Gain Bandwidth Product(GBP): 10MHz; Current - Input Bias(Ib): 1pA; Voltage - Input Offset(Vos): 500uV; Slew Rate(SR): 7V/us; Output Current: 30mA; Supply Current: 1mA; Operating Temperature: -40℃~+85℃
CN-5V CN-GND0 CN-GND1 CN-VLED0#2 CN-VLED1 = via
CN-VLED0 CN-VLED1#2 = 350211-1: Pins Structure:1x4P Pitch:5.08mm Mounting Style:- Reference Series:- Number of Pins:4P Number of Rows:1 Number of PINs Per Row:4 Row Spacing:- Contact Material:Phosphor Bronze; Supplier Part: C305826; Manufacturer: TE Connectivity(泰科电子); Supplier Footprint: 插件,P=5.08mm; JLCPCB Part Class: Extended Part; Datasheet: https://atta.szlcsc.com/upload/public/pdf/source/20181023/C305826_583FDBE646CDB1D1234F735D9E6CAEF3.pdf; Supplier: LCSC; Pins Structure: 1x4P; Pitch: 5.08mm; Number of Pins: 4P; Number of Rows: 1; Number of PINs Per Row: 4; Contact Material: Phosphor Bronze
J_MUX = ZX-PZ2.54-2-3PZZ: Pin Structure:2x3P Pitch:2.54mm Row Spacing:2.54mm Circluar Pins/Square Pins:Square Pins Mounting Type:Straight Number of Rows:双排 Number of Pins:6P Current Rating (Max):3A Voltage Rating (Max):1kV Length of Mating Pin:6mm Insulation Height:2.5mm Length of; LCSC Part Name: 2x3P 间距:2.54mm 方针 直插; Supplier Part: C7501274; Manufacturer: Megastar(兆星); Supplier Footprint: 插件,P=2.54mm; JLCPCB Part Class: Extended Part; Datasheet: https://atta.szlcsc.com/upload/public/pdf/source/20231122/E8390501A702A71E626C593F036B3607.pdf; Supplier: LCSC; Pin Structure: 2x3P; Pitch: 2.54mm; Row Spacing: 2.54mm; Circluar Pins/Square Pins: Square Pins; Mounting Type: Straight; Number of Rows: 双排; Number of Pins: 6P; Current Rating (Max): 3A; Voltage Rating (Max): 1kV; Length of Mating Pin: 6mm; Insulation Height: 2.5mm; Length of End Connection Pin: 3mm; Contact Plating: Gold; Operating Temperature Range: -40℃~+105℃; Color: Black
MUX0 MUX1 = CD74HC4067SM96: Switch Circuit:- Number of Channels:16 Supply Voltage:2V~6V Supply Voltage:2V~6V Turn-on time:90ns On-State Resistance (Max):240Ω Turn-off time:87ns Operating Temperature:-55℃~+125℃ Operating Temperature:-55℃~+125℃; LCSC Part Name: 高速CMOS逻辑16通道模拟多路复用器/解复用器; Supplier Part: C98457; Manufacturer: TI(德州仪器); Supplier Footprint: SSOP-24-208mil; JLCPCB Part Class: Extended Part; Datasheet: https://www.ti.com/cn/lit/gpn/cd74hc4067; Supplier: LCSC; Number of Channels: 16; Supply Voltage: 2V~6V; Turn-on time: 90ns; On-State Resistance (Max): 240Ω; Turn-off time: 87ns; Operating Temperature: -55℃~+125℃
SCALER_MUX0 SCALER_MUX1 = SN74LVC2G53DCTR: Switch Circuit:SPDT(SPDT) Number of Channels:2 Supply Voltage:1.65V~5.5V Supply Voltage:1.65V~5.5V On-State Resistance (Max):13Ω Operating Temperature:-40℃~+85℃ Operating Temperature:-40℃~+85℃; LCSC Part Name: SN74LVC2G53 单刀双掷 (SPDT) 模拟开关 2:1 模拟多路复用器/解复用器; Supplier Part: C201617; Manufacturer: TI(德州仪器); Supplier Footprint: MSOP-8-2.8mm; JLCPCB Part Class: Extended Part; Datasheet: https://www.ti.com/cn/lit/gpn/sn74lvc2g53; Supplier: LCSC; Switch Circuit: SPDT(SPDT); Number of Channels: 2; Supply Voltage: 1.65V~5.5V; On-State Resistance (Max): 13Ω; Operating Temperature: -40℃~+85℃
J_CS VLED1 = PZ2.54-2*4: Pin Structure:2x4P Pitch:2.54mm Number of Rows:双排 Number of Pins:8P; Supplier Part: C5156676; Manufacturer: ZHOURI(洲日); Supplier Footprint: 插件,P=2.54mm; JLCPCB Part Class: Extended Part; Datasheet: https://atta.szlcsc.com/upload/public/pdf/source/20220923/0E7A4A94740FFD503E2D73F36F92C1EA.pdf; Supplier: LCSC; Pin Structure: 2x4P; Pitch: 2.54mm; Number of Rows: 双排; Number of Pins: 8P
POT_GAIN0 POT_GAIN1 = 3296W-1-104_C118963: Resistance: Tolerance:±10% Tolerance:±10%; LCSC Part Name: 100kΩ ±10%; Supplier Part: C118963; Manufacturer: BOCHEN(博晨); Manufacturer Part: 3296W-1-104; Supplier Footprint: 插件; JLCPCB Part Class: Extended Part; Datasheet: https://atta.szlcsc.com/upload/public/pdf/source/20171114/C118963_15106326662041117450.pdf; Supplier: LCSC; Tolerance: ±10%
TEST-SCALER0 TEST-SCALER1 = HC-JN254-2-08-Z: Connector Type:简牛座 Pitch:2.54mm Structure:2x8P Current Rating (Max):3A Holder Type:Straight Row Spacing:2.54mm Number of Rows:2 Pin Number in each Row:8 Contact Material:Brass Contact Plating:Gold Operating Temperature Range:-40℃~+105℃ Operating Temperatu; LCSC Part Name: 2.54mm 2x8P 排数:2 每排P数:8; Supplier Part: C5372867; Manufacturer: HCTL(华灿天禄); Supplier Footprint: 插件,P=2.54mm; JLCPCB Part Class: Extended Part; Datasheet: https://atta.szlcsc.com/upload/public/pdf/source/20230316/69505B1ED1C4E6AD1FC7E030884C6E9A.pdf; Supplier: LCSC; Connector Type: 简牛座; Pitch: 2.54mm; Structure: 2x8P; Current Rating (Max): 3A; Holder Type: Straight; Row Spacing: 2.54mm; Number of Rows: 2; Pin Number in each Row: 8; Contact Material: Brass; Contact Plating: Gold; Operating Temperature Range: -40℃~+105℃; Soldering Temperature(Max): 260℃@10S
GPIO = ZX-IDC2.54-2-10PZZ: Connector Type:简牛座 Pitch:2.54mm Structure:2x10P Current Rating (Max):3A Voltage Rating (Max):1kV Holder Type:Straight Row Spacing:2.54mm Number of Rows:2 Pin Number in each Row:10 Contact Material:Brass Contact Plating:Gold Operating Temperature Range:-40; LCSC Part Name: 2.54mm 2x10P 排数:2 每排P数:10; Supplier Part: C7501245; Manufacturer: Megastar(兆星); Supplier Footprint: 插件,P=2.54mm; JLCPCB Part Class: Extended Part; Datasheet: https://atta.szlcsc.com/upload/public/pdf/source/20231122/326051A7BAD0E01EBB3DBE8FB30DA5B7.pdf; Supplier: LCSC; Connector Type: 简牛座; Pitch: 2.54mm; Structure: 2x10P; Current Rating (Max): 3A; Voltage Rating (Max): 1kV; Holder Type: Straight; Row Spacing: 2.54mm; Number of Rows: 2; Pin Number in each Row: 10; Contact Material: Brass; Contact Plating: Gold; Operating Temperature Range: -40℃~+105℃; Soldering Temperature(Max): 260℃@10S
J_LED = PZ254V-12-4P: Pin Structure:2x2P Pitch:2.54mm Row Spacing:2.54mm Circluar Pins/Square Pins:Square Pins Mounting Type:Straight Number of Rows:双排 Number of Pins:4P Current Rating (Max):- Voltage Rating (Max):- Length of Mating Pin:6mm Insulation Height:2.5mm Length of En; LCSC Part Name: 间距:2.54mm 2x2P 直插 方针; Supplier Part: C492419; Manufacturer: XFCN(兴飞); Supplier Footprint: 插件,P=2.54mm; JLCPCB Part Class: Extended Part; Datasheet: https://atta.szlcsc.com/upload/public/pdf/source/20200309/C492419_0001C06E73AFF21BD0ED3D7CEEF46D29.pdf; Supplier: LCSC; Pin Structure: 2x2P; Pitch: 2.54mm; Row Spacing: 2.54mm; Circluar Pins/Square Pins: Square Pins; Mounting Type: Straight; Number of Rows: 双排; Number of Pins: 4P; Length of Mating Pin: 6mm; Insulation Height: 2.5mm; Length of End Connection Pin: 3mm; Operating Temperature Range: -40℃~+105℃; Color: Black
U1 = TEENSY 4.1

## Nets
+3.3V: ADC0.13 ADC1.13 GPIO.18 R3.2 R4.2 R5.2 R6.2 R26.2 R27.2 TEST-SCALER0.14 TEST-SCALER1.14 U1.27(3.3V) U6.3(IN1+) U6.5(IN2+)
+5V: ADC0.16 ADC1.16 AOUT0.26 AOUT1.26 C6.2 CN-5V.1 DAC0.1(VDD) DAC0.9(SHDN#) DAC0.13(VREFA) DAC1.1(VDD) DAC1.9(SHDN#) DAC1.13(VREFA) GPIO.19 IO0.11 IO1.11 IO2.11 IO3.11 IO4.11 IO5.11 J_LED.4 J_MUX.1 J_MUX.2 MUX0.24(VCC) MUX1.24(VCC) SCALER_MUX0.8(VCC) SCALER_MUX1.8(VCC) TEST-SCALER0.15 TEST-SCALER1.15 TEST-TEENSY.16 U1.25(Vin) U6.8(VCC) U12.8(VDD) U13.8(VDD) U14.8(VDD) U15.8(VDD) U16.8(VDD) VLED1.1 VLED1.3 VLED1.5 VLED1.7
GND: ADC0.14 ADC1.14 AOUT0.25 AOUT1.25 C6.1 CN-GND0.1 CN-GND1.1 CN-VLED0.3 CN-VLED0.4 CN-VLED1#2.3 CN-VLED1#2.4 DAC0.8(LDAC#) DAC0.12(VSS) DAC1.8(LDAC#) DAC1.12(VSS) GPIO.20 IO0.12 IO0.15 IO0.16 IO1.12 IO1.15 IO1.16 IO2.12 IO2.15 IO2.16 IO3.12 IO3.15 IO3.16 IO4.12 IO4.15 IO4.16 IO5.12 IO5.15 IO5.16 J_LED.3 J_MUX.5 J_MUX.6 MUX0.12(GND) MUX0.16(I15) MUX0.17(I14) MUX0.18(I13) MUX0.19(I12) MUX1.12(GND) MUX1.16(I15) MUX1.17(I14) MUX1.18(I13) MUX1.19(I12) R1.1 R10.1 R32.1 R34.1 SCALER_MUX0.2(INH) SCALER_MUX0.3(GND) SCALER_MUX0.4(GND) SCALER_MUX1.2(INH) SCALER_MUX1.3(GND) SCALER_MUX1.4(GND) TEST-SCALER0.16 TEST-SCALER1.16 TEST-TEENSY.14 U1.1(GND) U1.26(GND) U6.4(VEE) U12.4(VSS) U13.4(VSS) U14.4(VSS) U15.4(VSS) U16.4(VSS)
3.3SIG0: J_LIMITER_OUTPUT.1 TEST-SCALER0.10 U16.6(VINB-) U16.7(VOUTB)
3.3SIG1: J_LIMITER_OUTPUT.3 TEST-SCALER1.10 U16.1(VOUTA) U16.2(VINA-)
5SIG0: J_LIMITER_INPUT.2 R31.1 TEST-SCALER0.9
5SIG1: J_LIMITER_INPUT.4 R33.1 TEST-SCALER1.9
#CS0: J_CS.1 U1.12(10)
#CS1: J_CS.3 U1.2(0 / RX1)
#CS2: GPIO.5 J_CS.5 U1.44(37)
#CS3: GPIO.7 J_CS.7 U1.45(36)
#CS_DAC0: DAC0.3(CS#) J_CS.2 R26.1
#CS_DAC1: DAC1.3(CS#) J_CS.4 R27.1
#CS_EXT0: ADC0.4 J_CS.6 R3.1
#CS_EXT1: ADC1.4 J_CS.8 R4.1
ADC0_FB0: J_GAIN_OFFSET.1 R18.2 R36.1 U14.2(VINA-)
ADC0_FB1: ADC0.1 ADC1.3 J_GAIN_OFFSET.2 J_LIMITER_INPUT.1 POT_GAIN0.1 POT_GAIN0.2 TEST-SCALER0.6 U14.1(VOUTA)
ADC1_FB0: J_GAIN_OFFSET.3 R28.2 R35.1 U15.2(VINA-)
ADC1_FB1: ADC0.3 ADC1.1 J_GAIN_OFFSET.4 J_LIMITER_INPUT.3 POT_GAIN1.1 POT_GAIN1.2 TEST-SCALER1.6 U15.1(VOUTA)
AM0: AOUT0.1 AOUT1.2 IO0.5 MUX0.9(I0)
AM1: AOUT0.3 AOUT1.4 IO0.6 MUX0.8(I1)
AM2: AOUT0.5 AOUT1.6 IO0.7 MUX0.7(I2)
AM3: AOUT0.7 AOUT1.8 IO0.8 MUX0.6(I3)
AM4: AOUT0.9 AOUT1.10 IO2.5 MUX0.5(I4)
AM5: AOUT0.11 AOUT1.12 IO2.6 MUX0.4(I5)
AM6: AOUT0.13 AOUT1.14 IO2.7 MUX0.3(I6)
AM7: AOUT0.15 AOUT1.16 IO2.8 MUX0.2(I7)
AM8: AOUT0.17 AOUT1.18 IO4.5 MUX0.23(I8)
AM9: AOUT0.19 AOUT1.20 IO4.6 MUX0.22(I9)
AM10: AOUT0.21 AOUT1.22 IO4.7 MUX0.21(I10)
AM11: AOUT0.23 AOUT1.24 IO4.8 MUX0.20(I11)
AM12: AOUT0.2 AOUT1.1 IO1.5 MUX1.9(I0)
AM13: AOUT0.4 AOUT1.3 IO1.6 MUX1.8(I1)
AM14: AOUT0.6 AOUT1.5 IO1.7 MUX1.7(I2)
AM15: AOUT0.8 AOUT1.7 IO1.8 MUX1.6(I3)
AM16: AOUT0.10 AOUT1.9 IO3.5 MUX1.5(I4)
AM17: AOUT0.12 AOUT1.11 IO3.6 MUX1.4(I5)
AM18: AOUT0.14 AOUT1.13 IO3.7 MUX1.3(I6)
AM19: AOUT0.16 AOUT1.15 IO3.8 MUX1.2(I7)
AM20: AOUT0.18 AOUT1.17 IO5.5 MUX1.23(I8)
AM21: AOUT0.20 AOUT1.19 IO5.6 MUX1.22(I9)
AM22: AOUT0.22 AOUT1.21 IO5.7 MUX1.21(I10)
AM23: AOUT0.24 AOUT1.23 IO5.8 MUX1.20(I11)
DRDY0: ADC0.6 U1.30(RX5 / 21)
DRDY1: ADC1.6 U1.33(18)
GAIN_IN0: J_SCALER_ROUT.4 R18.1 TEST-SCALER0.5
GAIN_IN1: J_SCALER_ROUT.8 R28.1 TEST-SCALER1.5
INV_OUT0: J_SCALER_ROUT.1 R23.2 TEST-SCALER0.3 U12.7(VOUTB)
INV_OUT1: J_SCALER_ROUT.5 R24.2 TEST-SCALER1.3 U13.7(VOUTB)
IO0: GPIO.2 U1.24(32)
IO1: GPIO.4 U1.23(31)
IO2: GPIO.6 U1.22(30)
IO3: GPIO.8 U1.21(29 / TX7)
IO4: GPIO.10 U1.20(28 / RX7) U1.36(RX3 / 15)
IO5: GPIO.12 U1.17(25 / RX6)
IO6: GPIO.14 U1.43(38)
IO7: GPIO.1 U1.48(33)
IO8: GPIO.3 U1.16(24 / TX6)
LDAC0: U1.46(TX8 / 35)
LDAC1: U1.47(RX8 / 34)
LDOUT1: IO0.10 IO2.9
LDOUT2: IO2.10 IO4.9
LDOUT3: IO1.9 IO4.10
LDOUT4: IO1.10 IO3.9
LDOUT5: IO3.10 IO5.9
LED_DATA: IO0.9 J_LED.2 TEST-TEENSY.10
LIMITER_IN0: J_LIMITER_INPUT.6 R11.1
LIMITER_IN1: J_LIMITER_INPUT.8 R12.1
LIMITER_OUT0: ADC0.5 ADC1.7 D9.2(A) J_LIMITER_OUTPUT.5 R11.2 TEST-SCALER0.4 U6.2(IN1-)
LIMITER_OUT1: ADC0.7 ADC1.5 D10.2(A) J_LIMITER_OUTPUT.7 R12.2 TEST-SCALER1.4 U6.6(IN2-)
MISO0: ADC0.8 R6.1 R10.2 U1.14(12)
MISO1: ADC1.8 R1.2 R5.1 U1.3(1 / TX1)
MOSI0: ADC0.10 DAC0.5(SDI) U1.13(11)
MOSI1: ADC1.10 DAC1.5(SDI) U1.18(26)
MUX_EN0: J_MUX.3 MUX0.15(E#)
MUX_EN1: J_MUX.4 MUX1.15(E#)
MUX_OUT0: ADC0.9 ADC1.11 MUX0.1(COMMON INOUT/OUTPUT) SCALER_MUX0.7(Y1) SCALER_MUX1.6(Y2) TEST-SCALER0.8
MUX_OUT1: ADC0.11 ADC1.9 MUX1.1(COMMON INOUT/OUTPUT) SCALER_MUX0.6(Y2) SCALER_MUX1.7(Y1) TEST-SCALER1.8
ONOFF: GPIO.15 U1.49(On / Off)
PROG: GPIO.17 U1.50(Prog)
PWDN0: ADC0.2 U1.28(23)
PWDN1: ADC1.2 U1.31(TX5 / 20)
RESET0: ADC0.15 U1.29(22)
RESET1: ADC1.15 U1.32(19)
SCALER_IN0: J_LIMITER_INPUT.5 R22.1 SCALER_MUX0.1(COM) TEST-SCALER0.2
SCALER_IN1: J_LIMITER_INPUT.7 R25.1 SCALER_MUX1.1(COM) TEST-SCALER1.2
SCLK0: ADC0.12 DAC0.4(SCK) U1.38(LED / 13)
SCLK1: ADC1.12 DAC1.4(SCK) U1.19(27)
SELECT0: IO0.1 IO1.1 IO2.1 IO3.1 IO4.1 IO5.1 TEST-TEENSY.1 U1.4(2)
SELECT1: IO0.2 IO1.2 IO2.2 IO3.2 IO4.2 IO5.2 TEST-TEENSY.3 U1.5(3)
SELECT2: IO0.3 IO1.3 IO2.3 IO3.3 IO4.3 IO5.3 TEST-TEENSY.5 U1.6(4)
SELECT3: IO0.4 IO1.4 IO2.4 IO3.4 IO4.4 IO5.4 TEST-TEENSY.7 U1.7(5)
SELECT4: MUX0.10(S0) MUX1.10(S0) TEST-TEENSY.9 U1.8(6)
SELECT5: MUX0.11(S1) MUX1.11(S1) TEST-TEENSY.11 U1.9(7 / RX2)
SELECT6: MUX0.14(S2) MUX1.14(S2) TEST-TEENSY.13 U1.10(8 / TX2)
SELECT7: MUX0.13(S3) MUX1.13(S3) TEST-TEENSY.15 U1.11(9)
SELECT_POL: GPIO.13 SCALER_MUX0.5(A) SCALER_MUX1.5(A) TEST-TEENSY.12 U1.37(TX3 / 14)
TADC0: J_LIMITER_OUTPUT.2 TEST-TEENSY.2 U1.35(RX4 / 16)
TADC1: J_LIMITER_OUTPUT.4 TEST-TEENSY.4 U1.41(40)
TADC2: J_LIMITER_OUTPUT.6 TEST-TEENSY.6 U1.40(41)
TADC3: J_LIMITER_OUTPUT.8 TEST-TEENSY.8 U1.42(39)
TLED_DATA: J_LED.1 R2.1
VADC: TEST-SCALER0.13 TEST-SCALER1.13
VGND0: J_GAIN_OFFSET.6 TEST-SCALER0.7 U12.5(VINB+) U14.3(VINA+)
VGND1: J_GAIN_OFFSET.8 TEST-SCALER1.7 U13.5(VINB+) U15.3(VINA+)
VLED: CN-VLED0.1 CN-VLED0.2 CN-VLED0#2.1 CN-VLED1.1 CN-VLED1#2.1 CN-VLED1#2.2 IO0.13 IO0.14 IO1.13 IO1.14 IO2.13 IO2.14 IO3.13 IO3.14 IO4.13 IO4.14 IO5.13 IO5.14 VLED1.2 VLED1.4 VLED1.6 VLED1.8
VOUTA_DAC0: DAC0.14(VOUTA) J_GAIN_OFFSET.5
VOUTA_DAC1: DAC1.14(VOUTA) J_GAIN_OFFSET.7
VOUTB_DAC0: DAC0.10(VOUTB) J_SCALER_ROUT.3
VOUTB_DAC1: DAC1.10(VOUTB) J_SCALER_ROUT.7
VREF: GPIO.16 TEST-SCALER0.12 TEST-SCALER1.12
VREFB_DAC0: DAC0.11(VREFB) J_SCALER_ROUT.2
VREFB_DAC1: DAC1.11(VREFB) J_SCALER_ROUT.6
$4N5866: R2.2 U1.34(TX4 / 17)
Net-(D9-1): D9.1(K) U6.1(OUT1)
Net-(D10-1): D10.1(K) U6.7(OUT2)
Net-(POT_GAIN0-3): POT_GAIN0.3 R36.2
Net-(POT_GAIN1-3): POT_GAIN1.3 R35.2
Net-(R22-2): R22.2 R23.1 U12.6(VINB-)
Net-(R24-1): R24.1 R25.2 U13.6(VINB-)
Net-(R31-2): R31.2 R32.2 U16.5(VINB+)
Net-(R33-2): R33.2 R34.2 U16.3(VINA+)

Not connected (* = marked no-connect by the designer): DAC0 2(NC)* 6(NC)* 7(NC)*; DAC1 2(NC)* 6(NC)* 7(NC)*; GPIO 9* 11*; IO5 10*; TEST-SCALER0 1* 11*; TEST-SCALER1 1* 11*; U1 15(3.3V)* 39(GND)* 51(GND)* 52(3.3V)* 53(VBat)*
